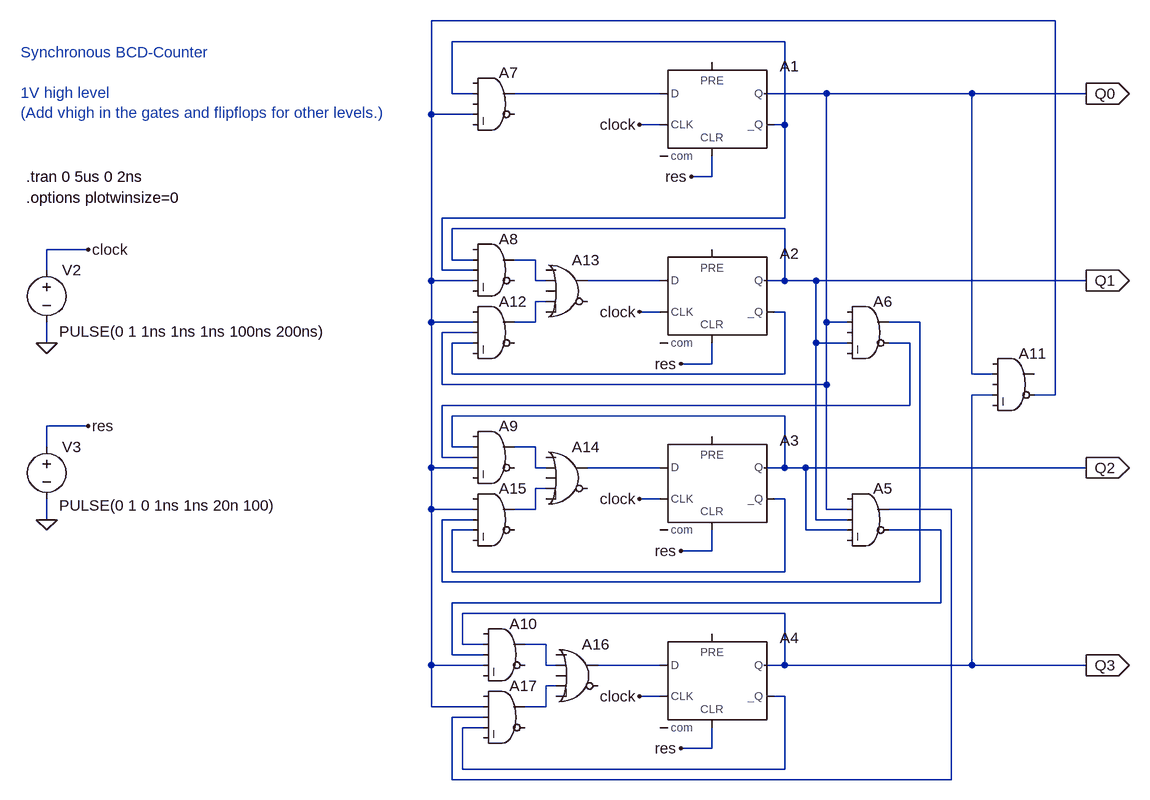
[diagram p0: schematic 4bit_bcd_counter.asc]
4bit_bcd_counter.asc, the LTspice schematic file:
Version 4
SHEET 1 880 1244
WIRE 576 48 -384 48
WIRE 160 80 -352 80
WIRE -352 160 -352 80
WIRE -320 160 -352 160
WIRE -32 160 -256 160
WIRE 224 160 128 160
WIRE 448 160 224 160
WIRE 624 160 448 160
WIRE -384 192 -384 48
WIRE -320 192 -384 192
WIRE -32 208 -64 208
WIRE 160 208 160 80
WIRE 160 208 144 208
WIRE 48 288 48 256
WIRE 48 288 16 288
WIRE 160 352 160 208
WIRE 160 352 -368 352
WIRE 160 368 -352 368
WIRE -912 400 -976 400
WIRE -352 416 -352 368
WIRE -320 416 -352 416
WIRE -224 416 -256 416
WIRE -976 432 -976 400
WIRE -368 432 -368 352
WIRE -320 432 -368 432
WIRE -384 448 -384 192
WIRE -320 448 -384 448
WIRE -224 448 -224 416
WIRE -208 448 -224 448
WIRE -32 448 -144 448
WIRE 160 448 160 368
WIRE 160 448 128 448
WIRE 208 448 160 448
WIRE 624 448 208 448
WIRE -208 480 -224 480
WIRE -32 496 -64 496
WIRE 160 496 144 496
WIRE -384 512 -384 448
WIRE -320 512 -384 512
WIRE -224 512 -224 480
WIRE -224 512 -256 512
WIRE 224 512 224 160
WIRE 256 512 224 512
WIRE 368 512 320 512
WIRE -320 528 -368 528
WIRE -976 544 -976 512
WIRE -320 544 -352 544
WIRE 208 544 208 448
WIRE 256 544 208 544
WIRE 352 544 320 544
WIRE 48 576 48 544
WIRE 48 576 0 576
WIRE -352 592 -352 544
WIRE 160 592 160 496
WIRE 160 592 -352 592
WIRE 448 592 448 160
WIRE 480 592 448 592
WIRE -368 608 -368 528
WIRE 224 608 224 512
WIRE 224 608 -368 608
WIRE 480 624 448 624
WIRE 576 624 576 48
WIRE 576 624 544 624
WIRE 352 640 352 544
WIRE 352 640 -368 640
WIRE 160 656 -352 656
WIRE -912 672 -976 672
WIRE -976 704 -976 672
WIRE -352 704 -352 656
WIRE -320 704 -352 704
WIRE -224 704 -256 704
WIRE -368 720 -368 640
WIRE -320 720 -368 720
WIRE -384 736 -384 512
WIRE -320 736 -384 736
WIRE -224 736 -224 704
WIRE -208 736 -224 736
WIRE -32 736 -144 736
WIRE 160 736 160 656
WIRE 160 736 128 736
WIRE 192 736 160 736
WIRE 624 736 192 736
WIRE -208 768 -224 768
WIRE -32 784 -64 784
WIRE 160 784 144 784
WIRE -384 800 -384 736
WIRE -320 800 -384 800
WIRE -224 800 -224 768
WIRE -224 800 -256 800
WIRE 224 800 224 608
WIRE 256 800 224 800
WIRE 416 800 320 800
WIRE -976 816 -976 784
WIRE -320 816 -368 816
WIRE 208 816 208 544
WIRE 256 816 208 816
WIRE -320 832 -352 832
WIRE 192 832 192 736
WIRE 256 832 192 832
WIRE 400 832 320 832
WIRE 48 864 48 832
WIRE 48 864 0 864
WIRE -352 896 -352 832
WIRE 160 896 160 784
WIRE 160 896 -352 896
WIRE -368 912 -368 816
WIRE 368 912 368 512
WIRE 368 912 -368 912
WIRE 400 944 400 832
WIRE 400 944 -352 944
WIRE 160 960 -336 960
WIRE -336 1008 -336 960
WIRE -304 1008 -336 1008
WIRE -208 1008 -240 1008
WIRE -352 1024 -352 944
WIRE -304 1024 -352 1024
WIRE -384 1040 -384 800
WIRE -304 1040 -384 1040
WIRE -208 1040 -208 1008
WIRE -192 1040 -208 1040
WIRE -32 1040 -128 1040
WIRE 160 1040 160 960
WIRE 160 1040 128 1040
WIRE 448 1040 448 624
WIRE 448 1040 160 1040
WIRE 624 1040 448 1040
WIRE -192 1072 -208 1072
WIRE -32 1088 -64 1088
WIRE 160 1088 144 1088
WIRE -384 1104 -384 1040
WIRE -304 1104 -384 1104
WIRE -208 1104 -208 1072
WIRE -208 1104 -240 1104
WIRE -304 1120 -352 1120
WIRE -304 1136 -336 1136
WIRE 48 1168 48 1136
WIRE 48 1168 0 1168
WIRE -336 1200 -336 1136
WIRE 160 1200 160 1088
WIRE 160 1200 -336 1200
WIRE -352 1216 -352 1120
WIRE 416 1216 416 800
WIRE 416 1216 -352 1216
FLAG 624 160 Q0
IOPIN 624 160 Out
FLAG 624 448 Q1
IOPIN 624 448 Out
FLAG 624 1040 Q3
IOPIN 624 1040 Out
FLAG -976 816 0
FLAG -976 544 0
FLAG 16 288 res
FLAG 0 576 res
FLAG 0 864 res
FLAG 0 1168 res
FLAG -912 672 res
FLAG -64 208 clock
FLAG -64 496 clock
FLAG -64 784 clock
FLAG -64 1088 clock
FLAG -912 400 clock
FLAG 624 736 Q2
IOPIN 624 736 Out
SYMBOL Digital\\dflop 48 112 R0
SYMATTR InstName A1
SYMATTR SpiceLine td=5n
SYMBOL Digital\\dflop 48 400 R0
SYMATTR InstName A2
SYMATTR Value2 td=5n
SYMBOL Digital\\dflop 48 688 R0
SYMATTR InstName A3
SYMATTR Value2 td=5n
SYMBOL Digital\\dflop 48 992 R0
SYMATTR InstName A4
SYMATTR SpiceLine td=5n
SYMBOL Digital\\and 288 752 R0
SYMATTR InstName A5
SYMBOL Digital\\and 288 464 R0
SYMATTR InstName A6
SYMBOL voltage -976 416 R0
WINDOW 123 0 0 Left 0
WINDOW 39 0 0 Left 0
WINDOW 3 19 110 Left 0
SYMATTR InstName V2
SYMATTR Value PULSE(0 1 1ns 1ns 1ns 100ns 200ns)
SYMBOL voltage -976 688 R0
WINDOW 123 0 0 Left 0
WINDOW 39 0 0 Left 0
WINDOW 3 19 106 Left 0
SYMATTR InstName V3
SYMATTR Value PULSE(0 1 0 1ns 1ns 20n 100)
SYMBOL Digital\\and -288 112 R0
SYMATTR InstName A7
SYMBOL Digital\\and -288 368 R0
SYMATTR InstName A8
SYMBOL Digital\\and -288 656 R0
SYMATTR InstName A9
SYMBOL Digital\\and 512 544 R0
SYMATTR InstName A11
SYMBOL Digital\\and -288 464 R0
SYMATTR InstName A12
SYMBOL Digital\\or -176 400 R0
SYMATTR InstName A13
SYMBOL Digital\\or -176 688 R0
SYMATTR InstName A14
SYMBOL Digital\\and -288 752 R0
SYMATTR InstName A15
SYMBOL Digital\\and -272 960 R0
SYMATTR InstName A10
SYMBOL Digital\\or -160 992 R0
SYMATTR InstName A16
SYMBOL Digital\\and -272 1056 R0
SYMATTR InstName A17
TEXT -1008 288 Left 0 !.tran 0 5us 0 2ns
TEXT -1008 320 Left 0 !.options plotwinsize=0
TEXT -1016 96 Left 0 ;Synchronous BCD-Counter\n \n1V high level\n(Add vhigh in the gates and flipflops for other levels.)

The netlist it stands for:
* 4bit_bcd_counter.asc
A1 N003 0 clock 0 res N002 Q0 0 DFLOP td=5n
A2 N005 0 clock 0 res N007 Q1 0 DFLOP td=5n
A3 N011 0 clock 0 res N013 Q2 0 DFLOP td=5n
A4 N017 0 clock 0 res N019 Q3 0 DFLOP td=5n
A5 0 Q0 Q1 Q2 0 N015 N014 0 AND
A6 0 Q0 0 Q1 0 N009 N008 0 AND
V2 clock 0 PULSE(0 1 1ns 1ns 1ns 100ns 200ns)
V3 res 0 PULSE(0 1 0 1ns 1ns 20n 100)
A7 0 N002 0 N001 0 0 N003 0 AND
A8 0 Q1 N002 N001 0 0 N004 0 AND
A9 0 Q2 N009 N001 0 0 N010 0 AND
A11 0 Q0 0 Q3 0 N001 0 0 AND
A12 0 N001 Q0 N007 0 0 N006 0 AND
A13 0 N004 0 N006 0 0 N005 0 OR
A14 0 N010 0 N012 0 0 N011 0 OR
A15 0 N001 N008 N013 0 0 N012 0 AND
A10 0 Q3 N015 N001 0 0 N016 0 AND
A16 0 N016 0 N018 0 0 N017 0 OR
A17 0 N001 N014 N019 0 0 N018 0 AND
.tran 0 5us 0 2ns
.options plotwinsize=0
* Synchronous BCD-Counter
* 1V high level
* (Add vhigh in the gates and flipflops for other levels.)
.backanno
.end